# Altium schematic sheet bluetooth.SchDoc: Bluetooth
size A4
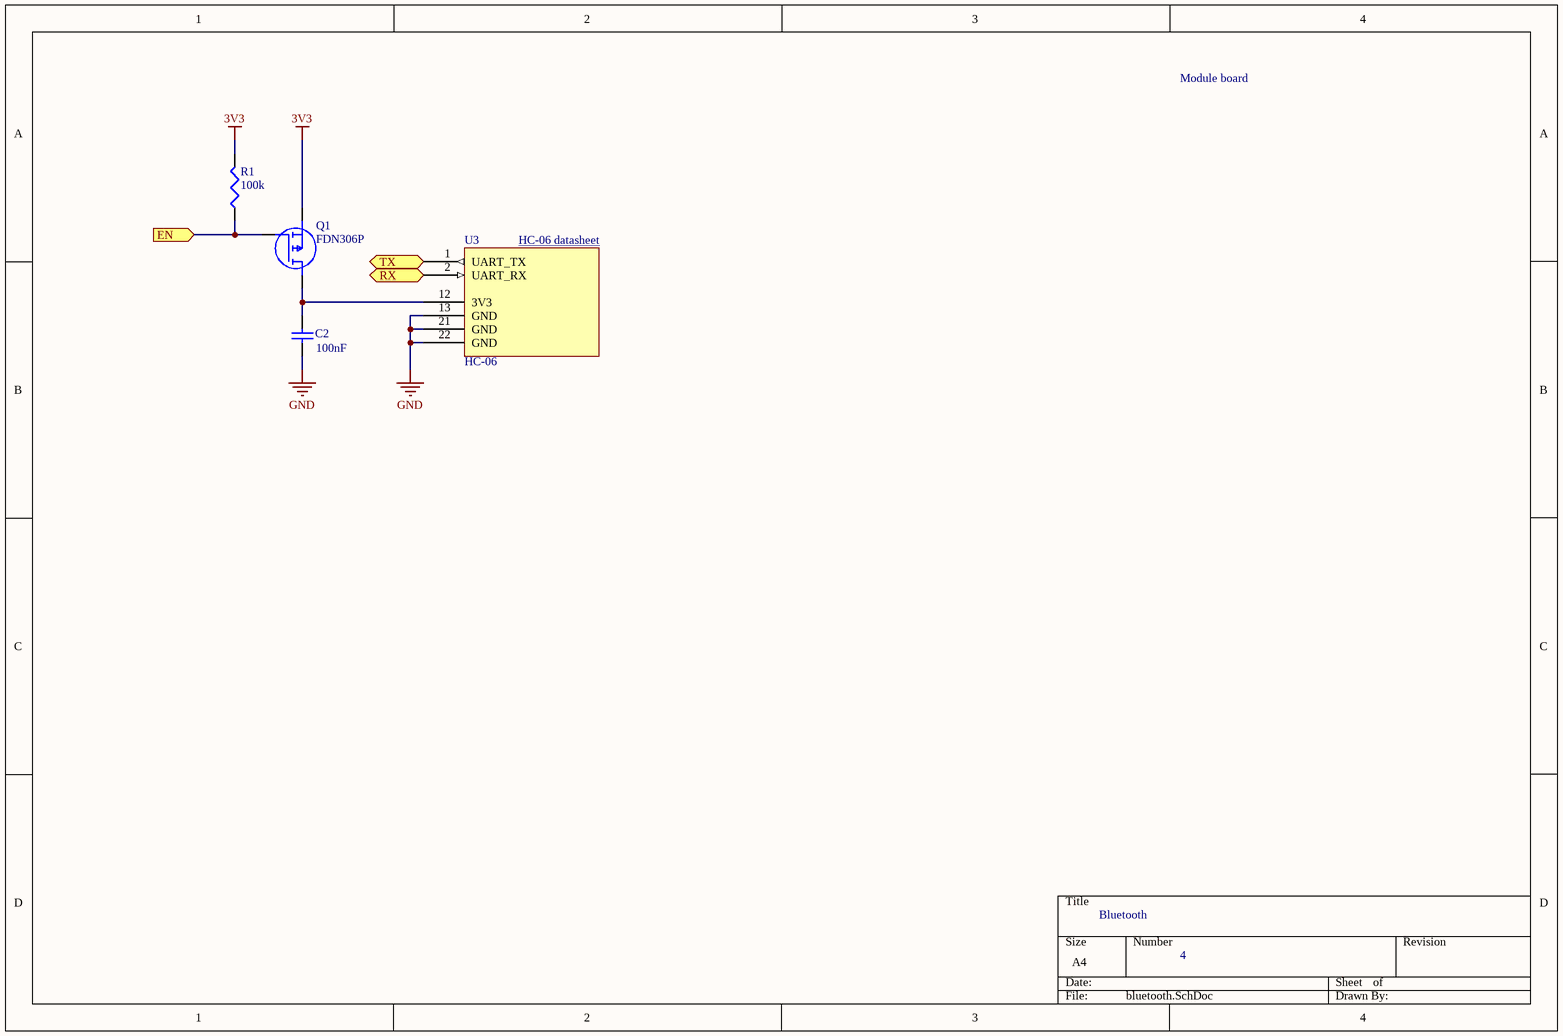
[diagram p0: bluetooth.SchDoc]

## Parts
C2  value 100nF  [C0805]  (hidden comment: Cap)
Q1  FDN306P  [SOT95P237X112-3N]
R1  value 100k  [R0603]  (hidden comment: Res3)
U3  HC-06  [HC-06_footprint_minimal_pin_number]

## Ports
EN (in), RX (in), TX (out)

## Nets
3V3: Q1.2(S) R1.2
GND: C2.1 U3.13(GND) U3.21(GND) U3.22(GND)
EN: Q1.1(G) R1.1 ; port EN
RX: U3.2(UART_RX) ; port RX
TX: U3.1(UART_TX) ; port TX
NetC2_2: C2.2 Q1.3(D) U3.12(3V3)

## Notes on the sheet
- Module board
- HC-06 datasheet <https://www.olimex.com/Products/Components/RF/BLUETOOTH-SERIAL-HC-06/resources/hc06.pdf>
- 4

## Library data of the parts
C2 = Cap: Capacitor; Published: 8-Jun-2000; LatestRevisionDate: 17-Jul-2002; LatestRevisionNote: Re-released for DXP Platform.; PackageReference: RAD-0.3; Publisher: Altium Limited; PackageDescription: Radial Cap, Thru-Hole; 2 Leads; 0.3 in Pin Spacing
Q1 = FDN306P: MOSFET (P-Channel); Manufacturer_Name: ON Semiconductor; Datasheet Link: http://uk.rs-online.com/web/p/products/1241702; Height: 1.12mm; Manufacturer_Part_Number: FDN306P; Arrow Part Number: FDN306P; Arrow Price/Stock: https://www.arrow.com/en/products/fdn306p/on-semiconductor; Mouser Part Number: 512-FDN306P; Mouser Price/Stock: https://www.mouser.co.uk/ProductDetail/ON-Semiconductor-Fairchild/FDN306P?qs=GeD7q9OHBPy9Kkc110idSQ%3D%3D
R1 = Res3: Resistor; Published: 8-Jun-2000; LatestRevisionDate: 29-May-2009; LatestRevisionNote: IPC-7351 Footprint Added.; PackageReference: J1-0603; Publisher: Altium Limited; PackageDescription: Chip Resistor
U3 = HC-06: HC-06 bluetooth module